# Altium schematic sheet motor_drive.SchDoc
size A4
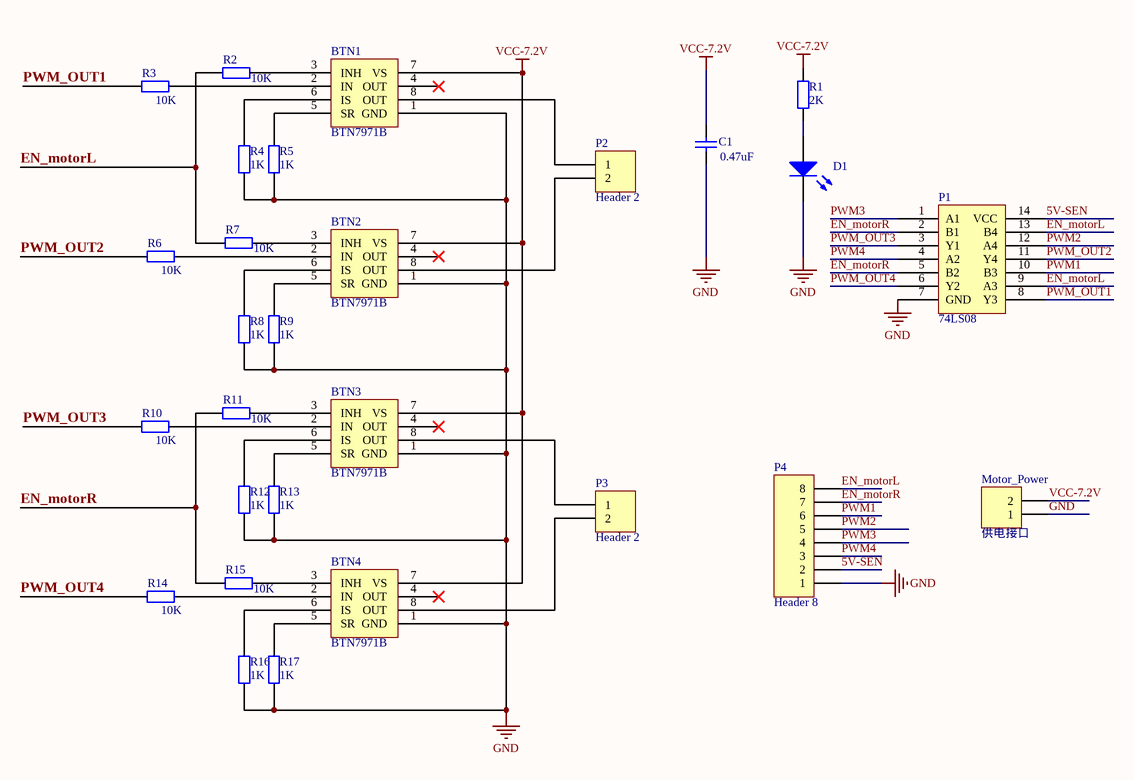
[diagram p0: motor_drive.SchDoc]

## Parts
BTN1  BTN7971B  [TO-263-7]
BTN2  BTN7971B  [TO-263-7]
BTN3  BTN7971B  [TO-263-7]
BTN4  BTN7971B  [TO-263-7]
C1  value 0.47uF  [3216]  (hidden comment: Cap)
D1  LED3  [C-0805]  (value not drawn)
Motor_Power  供电接口  [P_Header]
P1  74LS08  [DIP-14]
P2  Header 2  [PCBComponent_1]
P3  Header 2  [PCBComponent_1]
P4  Header 8  [HDR1X8]
R1  value 2K  [0805]  (hidden comment: Res2)
R2  value 10K  [0805]  (hidden comment: Res2)
R3  value 10K  [0805]  (hidden comment: Res2)
R4  value 1K  [0805]  (hidden comment: Res2)
R5  value 1K  [0805]  (hidden comment: Res2)
R6  value 10K  [0805]  (hidden comment: Res2)
R7  value 10K  [0805]  (hidden comment: Res2)
R8  value 1K  [0805]  (hidden comment: Res2)
R9  value 1K  [0805]  (hidden comment: Res2)
R10  value 10K  [0805]  (hidden comment: Res2)
R11  value 10K  [0805]  (hidden comment: Res2)
R12  value 1K  [0805]  (hidden comment: Res2)
R13  value 1K  [0805]  (hidden comment: Res2)
R14  value 10K  [0805]  (hidden comment: Res2)
R15  value 10K  [0805]  (hidden comment: Res2)
R16  value 1K  [0805]  (hidden comment: Res2)
R17  value 1K  [0805]  (hidden comment: Res2)

## Nets
GND: BTN1.1(GND) BTN2.1(GND) BTN3.1(GND) BTN4.1(GND) C1.1 D1.2(K) Motor_Power.1 P1.7(GND) P4.1 R4.1 R5.1 R8.1 R9.1 R12.1 R13.1 R16.1 R17.1
VCC-7.2V: BTN1.7(VS) BTN2.7(VS) BTN3.7(VS) BTN4.7(VS) C1.2 Motor_Power.2 R1.2
5V-SEN: P1.14(VCC) P4.2
EN_motorL: P1.9(A3) P1.13(B4) P4.8 R2.1 R7.1
EN_motorR: P1.2(B1) P1.5(B2) P4.7 R11.1 R15.1
PWM1: P1.10(B3) P4.6
PWM2: P1.12(A4) P4.5
PWM3: P1.1(A1) P4.4
PWM4: P1.4(A2) P4.3
PWM_OUT1: P1.8(Y3) R3.1
PWM_OUT2: P1.11(Y4) R6.1
PWM_OUT3: P1.3(Y1) R10.1
PWM_OUT4: P1.6(Y2) R14.1
NetBTN1_2: BTN1.2(IN) R3.2
NetBTN1_3: BTN1.3(INH) R2.2
NetBTN1_5: BTN1.5(SR) R5.2
NetBTN1_6: BTN1.6(IS) R4.2
NetBTN1_8: BTN1.8(OUT) P2.1
NetBTN2_2: BTN2.2(IN) R6.2
NetBTN2_3: BTN2.3(INH) R7.2
NetBTN2_5: BTN2.5(SR) R9.2
NetBTN2_6: BTN2.6(IS) R8.2
NetBTN2_8: BTN2.8(OUT) P2.2
NetBTN3_2: BTN3.2(IN) R10.2
NetBTN3_3: BTN3.3(INH) R11.2
NetBTN3_5: BTN3.5(SR) R13.2
NetBTN3_6: BTN3.6(IS) R12.2
NetBTN3_8: BTN3.8(OUT) P3.1
NetBTN4_2: BTN4.2(IN) R14.2
NetBTN4_3: BTN4.3(INH) R15.2
NetBTN4_5: BTN4.5(SR) R17.2
NetBTN4_6: BTN4.6(IS) R16.2
NetBTN4_8: BTN4.8(OUT) P3.2
NetD1_1: D1.1(A) R1.1

Not connected (* = marked no-connect by the designer): BTN1 4(OUT)*; BTN2 4(OUT)*; BTN3 4(OUT)*; BTN4 4(OUT)*

## Library data of the parts
BTN1-BTN4 P1-P3 = Component_1
C1 = Cap: Capacitor; Published: 8-Jun-2000; LatestRevisionDate: 17-Jul-2002; LatestRevisionNote: Re-released for DXP Platform.; PackageReference: C-3216; Publisher: Altium Limited; PackageDescription: Radial Cap, Thru-Hole; 2 Leads; 0.3 in Pin Spacing
D1 = LED3: Typical BLUE SiC LED; Published: 8-Jun-2000; LatestRevisionDate: 17-Dec-2003; LatestRevisionNote: PCB Footprint replaced.; DatasheetDocument: 16-Apr-2002; PackageDocument: 16-Apr-2002; PackageReference: 3.5X2.8X1.9; Publisher: Altium Limited
Motor_Power = Header 2: Header, 2-Pin; LatestRevisionDate: 17-Jul-2002; LatestRevisionNote: Re-released for DXP Platform.; Publisher: Altium Limited
P4 = Header 8: Header, 8-Pin; LatestRevisionDate: 17-Jul-2002; LatestRevisionNote: Re-released for DXP Platform.; Publisher: Altium Limited
R1-R17 = Res2: Resistor; Published: 8-Jun-2000; LatestRevisionDate: 17-Jul-2002; LatestRevisionNote: Re-released for DXP Platform.; PackageReference: AXIAL-0.4; Publisher: Altium Limited
  R2-R17: PackageDescription: Axial Device, Thru-Hole; 2 Leads; 0.4 in Pin Spacing